# EAGLE schematic PSD_Mount_v6 (EAGLE 9.7.0)
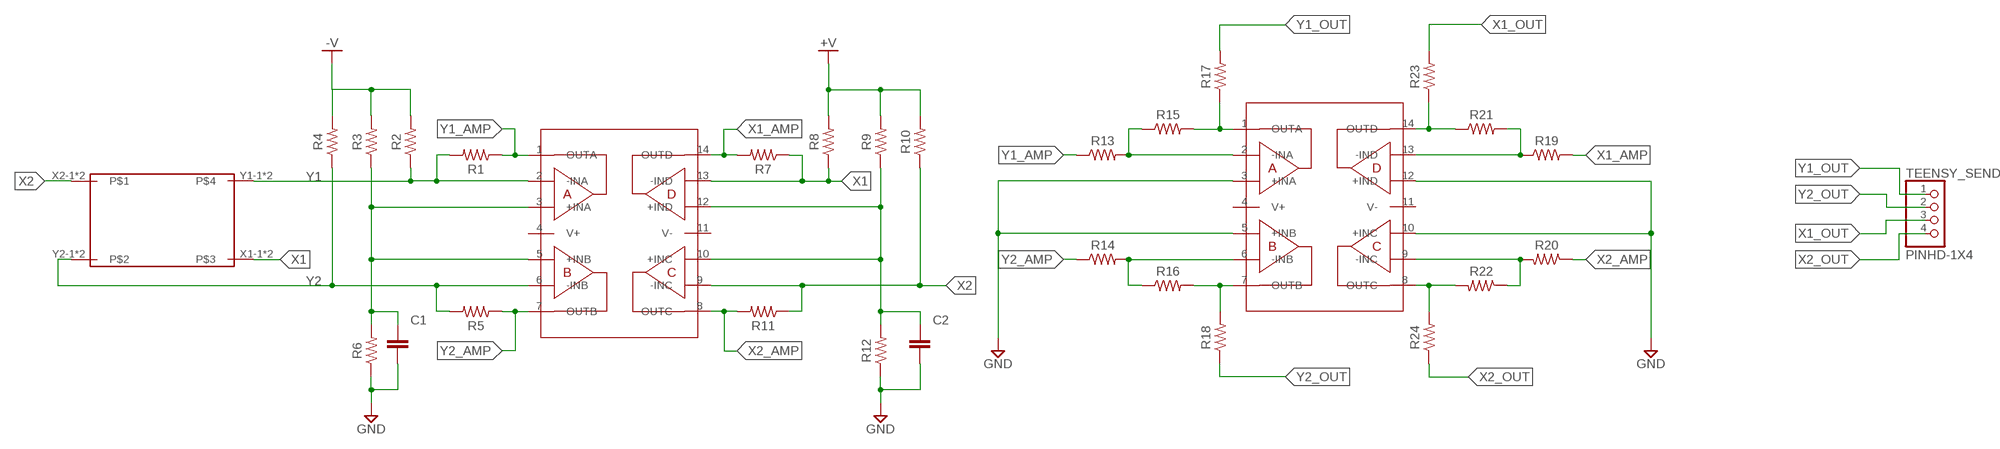
[diagram p0: schematic, sheet 1]

## Parts
C1  C_CHIP-0805(2012-METRIC)  [CAPC2012X110]
C2  C_CHIP-0805(2012-METRIC)  [CAPC2012X110]
R1  R-US_CHIP-0805(2012-METRIC)  [RESC2012X65]
R2  R-US_CHIP-0805(2012-METRIC)  [RESC2012X65]
R3  R-US_CHIP-0805(2012-METRIC)  [RESC2012X65]
R4  R-US_CHIP-0805(2012-METRIC)  [RESC2012X65]
R5  R-US_CHIP-0805(2012-METRIC)  [RESC2012X65]
R6  R-US_CHIP-0805(2012-METRIC)  [RESC2012X65]
R7  R-US_CHIP-0805(2012-METRIC)  [RESC2012X65]
R8  R-US_CHIP-0805(2012-METRIC)  [RESC2012X65]
R9  R-US_CHIP-0805(2012-METRIC)  [RESC2012X65]
R10  R-US_CHIP-0805(2012-METRIC)  [RESC2012X65]
R11  R-US_CHIP-0805(2012-METRIC)  [RESC2012X65]
R12  R-US_CHIP-0805(2012-METRIC)  [RESC2012X65]
R13  R-US_CHIP-0805(2012-METRIC)  [RESC2012X65]
R14  R-US_CHIP-0805(2012-METRIC)  [RESC2012X65]
R15  R-US_CHIP-0805(2012-METRIC)  [RESC2012X65]
R16  R-US_CHIP-0805(2012-METRIC)  [RESC2012X65]
R17  R-US_CHIP-0805(2012-METRIC)  [RESC2012X65]
R18  R-US_CHIP-0805(2012-METRIC)  [RESC2012X65]
R19  R-US_CHIP-0805(2012-METRIC)  [RESC2012X65]
R20  R-US_CHIP-0805(2012-METRIC)  [RESC2012X65]
R21  R-US_CHIP-0805(2012-METRIC)  [RESC2012X65]
R22  R-US_CHIP-0805(2012-METRIC)  [RESC2012X65]
R23  R-US_CHIP-0805(2012-METRIC)  [RESC2012X65]
R24  R-US_CHIP-0805(2012-METRIC)  [RESC2012X65]
TEENSY_SEND  PINHD-1X4  [1X04]
U$1  2L10UV_SU7  [2L10UV_SU7]
U$2  OPA4140  [SOP65P640X120-14N]
U$3  OPA4140  [SOP65P640X120-14N]

## Nets
+V: R8.2 R9.2 R10.2
-V: R2.2 R3.2 R4.2
GND: C1.2 C2.2 R6.1 R12.1 U$3.3(+INA) U$3.5(+INB) U$3.10(+INC) U$3.12(+IND)
N$1: R13.2 R15.1 U$3.2(-INA)
N$2: C1.1 R3.1 R6.2 U$2.3(+INA) U$2.5(+INB)
N$3: R14.2 R16.1 U$3.6(-INB)
N$4: R15.2 R17.1 U$3.1(OUTA)
N$5: R16.2 R18.2 U$3.7(OUTB)
N$7: C2.1 R9.1 R12.2 U$2.10(+INC) U$2.12(+IND)
N$8: R20.2 R22.1 U$3.9(-INC)
N$9: R21.1 R23.1 U$3.14(OUTD)
N$10: R22.2 R24.2 U$3.8(OUTC)
N$11: R19.1 R21.2 U$3.13(-IND)
X1: R7.1 R8.1 U$1.X1-1 U$1.X1-2 U$2.13(-IND)
X1_AMP: R7.2 R19.2 U$2.14(OUTD)
X1_OUT: R23.2 TEENSY_SEND.3
X2: R10.1 R11.1 U$1.X2-1 U$1.X2-2 U$2.9(-INC)
X2_AMP: R11.2 R20.1 U$2.8(OUTC)
X2_OUT: R24.1 TEENSY_SEND.4
Y1: R1.2 R2.1 U$1.Y1-1 U$1.Y1-2 U$2.2(-INA)
Y1_AMP: R1.1 R13.1 U$2.1(OUTA)
Y1_OUT: R17.2 TEENSY_SEND.1
Y2: R4.1 R5.2 U$1.Y2-1 U$1.Y2-2 U$2.6(-INB)
Y2_AMP: R5.1 R14.1 U$2.7(OUTB)
Y2_OUT: R18.1 TEENSY_SEND.2
Unconnected: U$2.4(V+) U$2.11(V-) U$3.4(V+) U$3.11(V-)

## Library data of the parts
C1 C2 = Capacitor:C: Capacitor - Generic; CATEGORY: Capacitor
R1-R24 = Resistor:R-US: Resistor Fixed - ANSI; CATEGORY: Resistor; SUB-CATEGORY: Fixed
TEENSY_SEND = Connector:PINHD-1X4: PIN HEADER; CATEGORY: CONNECTOR; SUB-CATEGORY: PIN-HEADER
U$1 = 2L10UV-MP1:2L10UV_SU7
U$2 U$3 = OPA4140:OPA4140